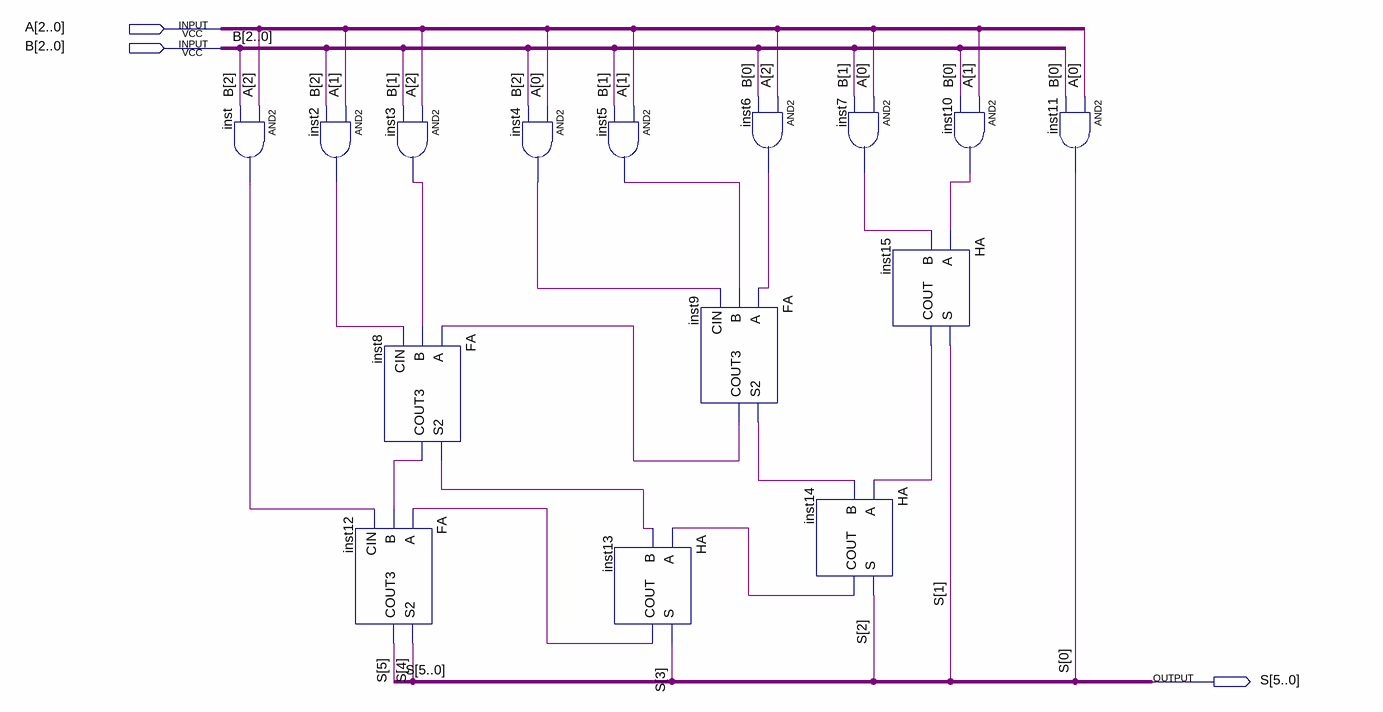
[diagram p0: schematic sheet]
// Quartus schematic MACHNHAN.bdf as structural Verilog: 15 symbols, 3 pins
module MACHNHAN (
  input  [2:0] A,
  input  [2:0] B,
  output [5:0] S
);

  wire inst2_out, inst3_out, inst4_out, inst5_out, inst6_out, inst7_out, inst8_cout3, inst8_s2, inst9_cout3,
       inst9_s2, inst10_out, inst13_cout, inst14_cout, inst15_cout, inst_out;

  and inst (inst_out, A[2], B[2]);
  and inst2 (inst2_out, A[1], B[2]);
  FA inst8 (.A(inst9_cout3), .B(inst3_out), .CIN(inst2_out), .S2(inst8_s2), .COUT3(inst8_cout3));
  FA inst12 (.A(inst13_cout), .B(inst8_cout3), .CIN(inst_out), .S2(S[4]), .COUT3(S[5]));
  and inst3 (inst3_out, A[2], B[1]);
  and inst4 (inst4_out, A[0], B[2]);
  and inst5 (inst5_out, A[1], B[1]);
  HA inst13 (.A(inst14_cout), .B(inst8_s2), .S(S[3]), .COUT(inst13_cout));
  and inst6 (inst6_out, A[2], B[0]);
  FA inst9 (.A(inst6_out), .B(inst5_out), .CIN(inst4_out), .S2(inst9_s2), .COUT3(inst9_cout3));
  HA inst14 (.A(inst15_cout), .B(inst9_s2), .S(S[2]), .COUT(inst14_cout));
  and inst7 (inst7_out, A[0], B[1]);
  HA inst15 (.A(inst10_out), .B(inst7_out), .S(S[1]), .COUT(inst15_cout));
  and inst10 (inst10_out, A[1], B[0]);
  and inst11 (S[0], A[0], B[0]);
endmodule
